# EAGLE schematic Prototype_Schematic (EAGLE 7.1.0)
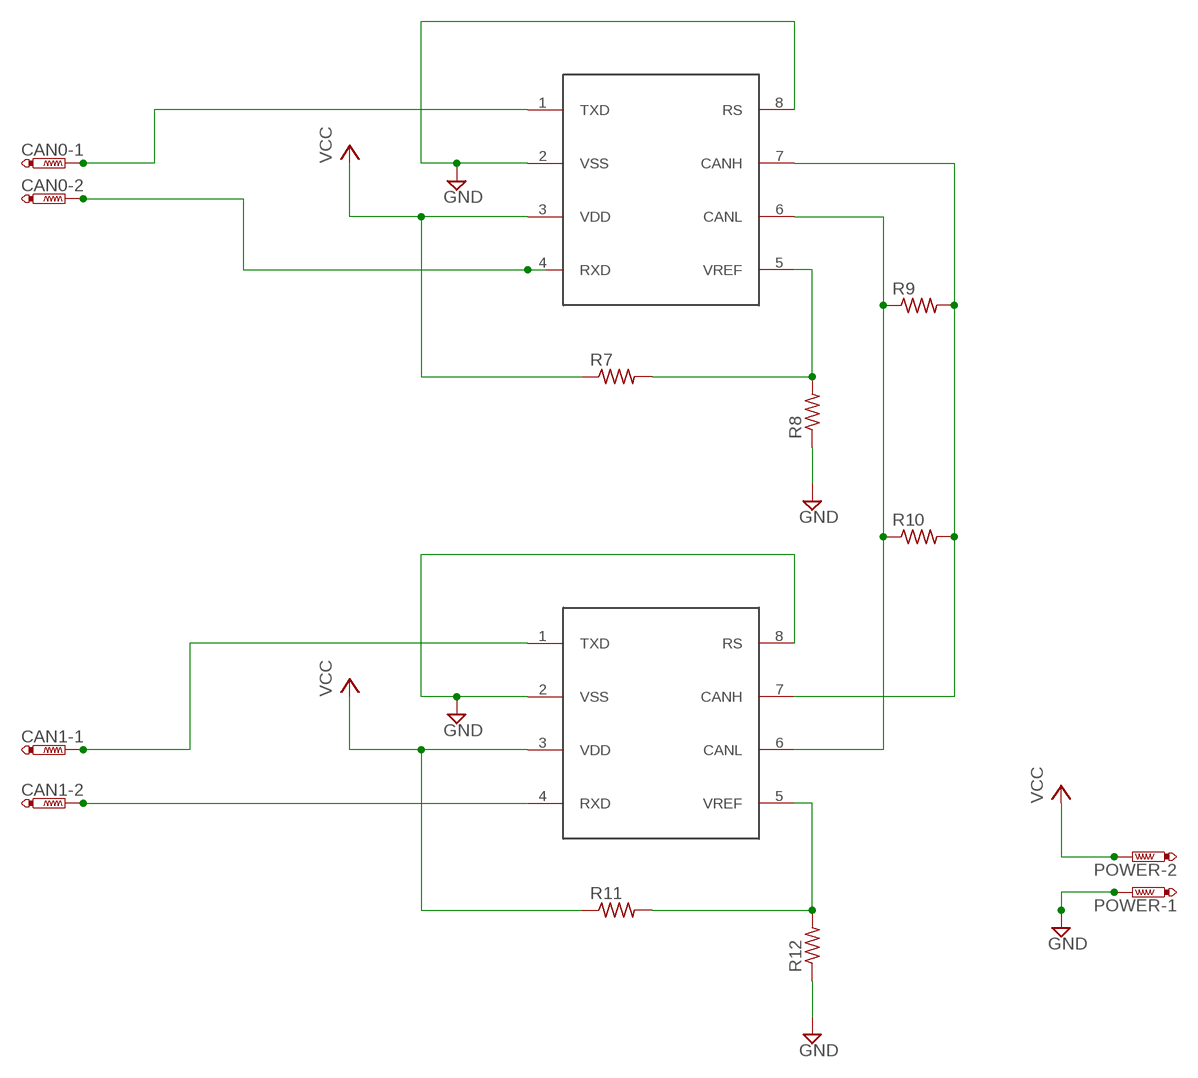
[diagram p0: schematic, sheet 1]

## Parts
CAN0  PTR2  [P2-38-17]
CAN1  PTR2  [P2-38-17]
POWER  PTR2  [P2-38-17]
R7  R-US_0204/5  [0204/5]
R8  R-US_0204/5  [0204/5]
R9  R-US_0204/5  [0204/5]
R10  R-US_0204/5  [0204/5]
R11  R-US_0204/5  [0204/5]
R12  R-US_0204/5  [0204/5]
U$2  MCP2551-DIP  [DIL08]
U$3  MCP2551-DIP  [DIL08]

## Nets
GND: POWER.TP-1 R8.1 R12.1 U$2.2(VSS) U$2.8(RS) U$3.2(VSS) U$3.8(RS)
N$3: R7.2 R8.2 U$2.5(VREF)
N$4: R9.2 R10.2 U$2.7(CANH) U$3.7(CANH)
N$7: R11.2 R12.2 U$3.5(VREF)
N$8: R9.1 R10.1 U$2.6(CANL) U$3.6(CANL)
RX1: CAN0.TP-2 U$2.4(RXD)
RX2: CAN1.TP-2 U$3.4(RXD)
TX1: CAN0.TP-1 U$2.1(TXD)
TX2: CAN1.TP-1 U$3.1(TXD)
VCC: POWER.TP-2 R7.1 R11.1 U$2.3(VDD) U$3.3(VDD)

## Library data of the parts
CAN0 CAN1 POWER = testpad:PTR2: TEST PIN
R7-R12 = resistor:R-US_: RESISTOR, American symbol
U$2 U$3 = Dash parts:MCP2551-DIP